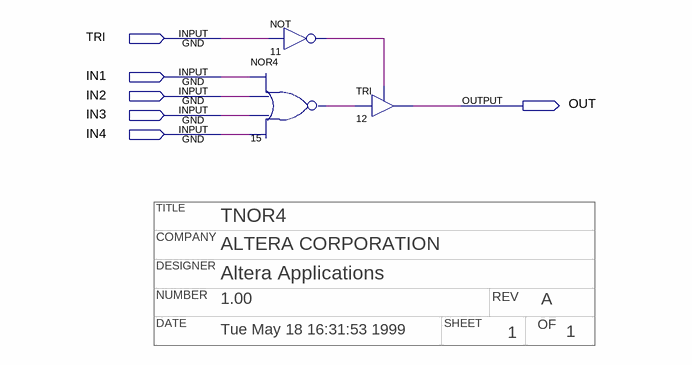
[diagram p0: schematic sheet]
// Quartus schematic tnor4.bdf as structural Verilog: 3 symbols, 6 pins
// Title block: TITLE: TNOR4; COMPANY: ALTERA CORPORATION; DESIGNER: Altera Applications; NUMBER: 1.00; REV: A; DATE: Tue May 18 16:31:53 1999; SHEET: 1; OF: 1
module tnor4 (
  input  TRI,
  input  IN1,
  input  IN2,
  input  IN3,
  input  IN4,
  output OUT
);

  wire n11_out, n15_out;

  not u_11 (n11_out, TRI);
  nor u_15 (n15_out, IN1, IN2, IN3, IN4);
  TRI u_12 (.IN(n15_out), .OE(n11_out), .OUT(OUT));
endmodule
